# EasyEDA Pro project ProPrj_CWATCH_2025-07-30.epro, schematic Schematic2
Board Name: Board2; Create Date: 2025-07-18; Page Name: P1; Project Name: CWATCH; Schematic Name: Schematic2; Update Date: 2025-07-28; Company: EasyEDA.com; Page Size: A4; Version: V1.0
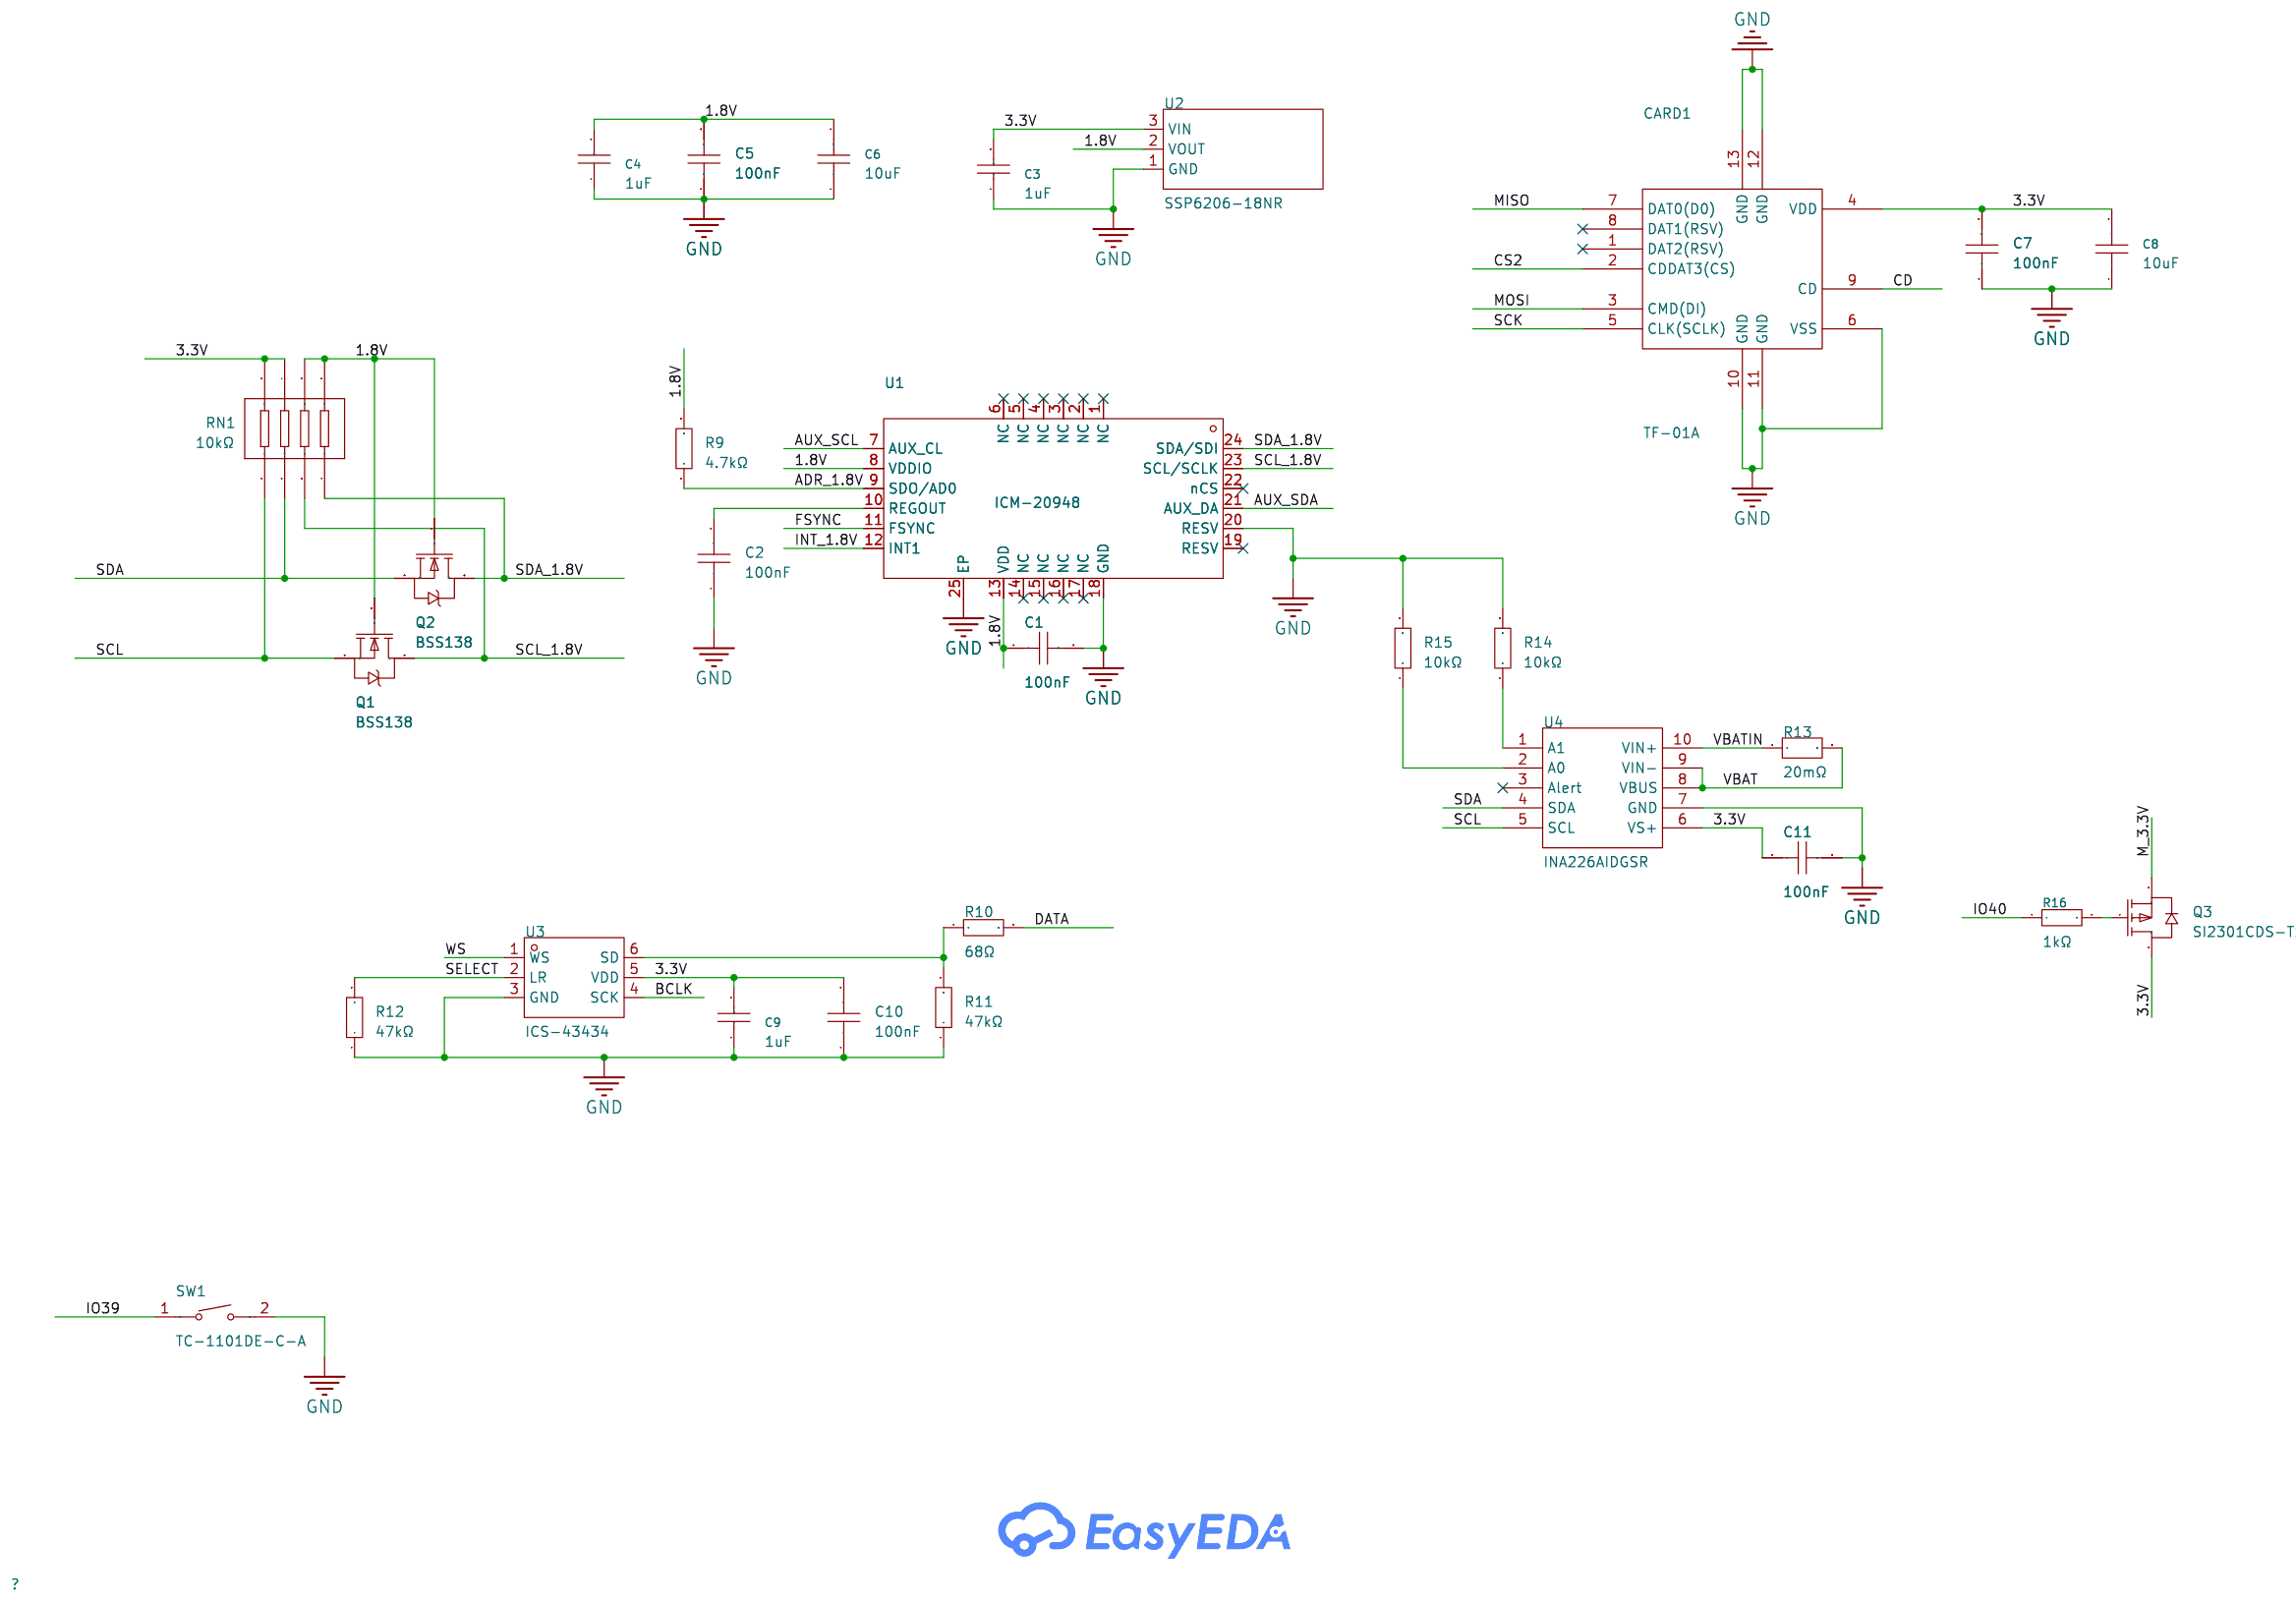
[diagram p2: schematic sheet]

## Parts
C1  100nF  [C0402]
C2  100nF  [C0402]
C3  1uF  [C0402]
C4  1uF  [C0402]
C5  100nF  [C0402]
C6  10uF  [C0603]
C7  100nF  [C0402]
C8  10uF  [C0603]
C9  1uF  [C0402]
C10  100nF  [C0402]
C11  100nF  [C0402]
CARD1  TF-01A  [TF-SMD_TF-01A]
Q1  BSS138  [SOT-23-3_L2.9-W1.6-P1.90-LS2.8-BR]
Q2  BSS138  [SOT-23-3_L2.9-W1.6-P1.90-LS2.8-BR]
Q3  SI2301CDS-T1-GE3  [SOT-23-3_L3.0-W1.7-P0.95-LS2.9-BR]
R9  4.7kΩ  [R0603]
R10  68Ω  [R0603]
R11  47kΩ  [R0402]
R12  47kΩ  [R0402]
R13  20mΩ  [RES-SMD_L6.4-W3.2-R2512]
R14  10kΩ  [R0402]
R15  10kΩ  [R0402]
R16  1kΩ  [R0402]
RN1  10kΩ  [RES-ARRAY-SMD_0402-8P-L2.0-W1.0-BL]
SW1  TC-1101DE-C-A  [KEY-TH_L6.1-W3.8-P5.08]
U1  ICM-20948  [QFN-24_L3.0-W3.0-P0.40-BL-EP]
U2  SSP6206-18NR  [SOT-23-3_L2.9-W1.3-P1.90-LS2.4-BR]
U3  ICS-43434  [MIC-SMD_6P-L3.5-W2.7-P0.90-BL]
U4  INA226AIDGSR  [MSOP-10_L3.0-W3.0-P0.50-LS5.0-BL]

## Library data of the parts
C1 C2 C5 C7 C10 C11 = CL05B104KB54PNC: Capacitance: Tolerance:±10% Tolerance:±10% Voltage Rated: Temperature Coefficient:; LCSC Part Name: 100nF ±10% 50V; Supplier Part: C307331; Manufacturer: SAMSUNG(三星); Supplier Footprint: 0402; JLCPCB Part Class: Basic Part; Datasheet: https://atta.szlcsc.com/upload/public/pdf/source/20160218/1457707763339.pdf; Supplier: LCSC; Tolerance: ±10%
C3 C4 C9 = CL05A105KA5NQNC: Capacitance: Tolerance:±10% Tolerance:±10% Voltage Rated: Temperature Coefficient:; LCSC Part Name: 1uF ±10% 25V; Supplier Part: C52923; Manufacturer: SAMSUNG(三星); Supplier Footprint: 0402; JLCPCB Part Class: Basic Part; Datasheet: https://atta.szlcsc.com/upload/public/pdf/source/20160218/1457707763339.pdf; Supplier: LCSC; Tolerance: ±10%
C6 C8 = CL10A106MA8NRNC: Capacitance: Tolerance:±20% Tolerance:±20% Voltage Rated: Temperature Coefficient:; LCSC Part Name: 10uF ±20% 25V; Supplier Part: C96446; Manufacturer: SAMSUNG(三星); Supplier Footprint: 0603; JLCPCB Part Class: Basic Part; Datasheet: https://atta.szlcsc.com/upload/public/pdf/source/20160218/1457707763339.pdf; Supplier: LCSC; Tolerance: ±20%
CARD1 = TF-01A_C91145: Card Connection Mode:Self-bouncing Card Type:MicroSD card (TF card) Connector Type:Card Slot Additional Card Detection Pins:- Supplementary Features:With Locating Pin Maximum Body Height:1.85mm Operating Temperature Range:- Operating Temperature Range:-; LCSC Part Name: 自弹式 MicroSD卡(TF卡) 卡座; Supplier Part: C91145; Manufacturer: 韩国韩荣; Supplier Footprint: SMD; JLCPCB Part Class: Extended Part; Datasheet: https://atta.szlcsc.com/upload/public/pdf/source/20190322/C91145_63CBD6FB4639A3A3EC6A9721F18AE0FB.pdf; Supplier: LCSC; Card Connection Mode: Self-bouncing; Card Type: MicroSD card (TF card); Connector Type: Card Slot; Supplementary Features: With Locating Pin; Maximum Body Height: 1.85mm
Q1 Q2 = BSS138_C52895: Type:1 N-Channel Drain Source Voltage (Vdss): Continuous Drain Current (Id):220mA Drain Source On Resistance (RDS(on)@Vgs,Id):3.5Ω@10V,0.22A Power Dissipation (Pd):360mW Gate Threshold Voltage (Vgs(th)@Id):1.5V@1mA Total Gate Charge (Qg@Vgs):2.4nC@25V Inp; LCSC Part Name: 1个N沟道 耐压:50V 电流:220mA; Supplier Part: C52895; Manufacturer: onsemi(安森美); Supplier Footprint: SOT-23; JLCPCB Part Class: Extended Part; Datasheet: https://atta.szlcsc.com/upload/public/pdf/source/20170412/1491969107299.pdf; Supplier: LCSC; Type: 1 N-Channel; Continuous Drain Current (Id): 220mA; Drain Source On Resistance (RDS(on)@Vgs,Id): 3.5Ω@10V,0.22A; Power Dissipation (Pd): 360mW; Gate Threshold Voltage (Vgs(th)@Id): 1.5V@1mA; Total Gate Charge (Qg@Vgs): 2.4nC@25V; Input Capacitance (Ciss@Vds): 27pF@25V; Reverse Transfer Capacitance (Crss@Vds): 6pF; Operating Temperature: -55℃~+150℃
Q3 = SI2301CDS-T1-GE3: Number:1 piece P-channel Drain to Source Voltage:20V Current - Continuous Drain(Id):2.3A RDS(on):112mΩ@4.5V,2.8A Pd - Power Dissipation:860mW Gate Threshold Voltage (Vgs(th)@Id):1V Gate Charge(Qg):3.3nC@10V Input Capacitance(Ciss@Vds):405pF@10V Reverse Tr; LCSC Part Name: 1个P沟道 耐压:20V 电流:2.3A; Supplier Part: C10487; Manufacturer: VISHAY(威世); Supplier Footprint: SOT-23; JLCPCB Part Class: Basic Part; Datasheet: https://atta.szlcsc.com/upload/public/pdf/source/20180621/C10487_757133A2CC00440C4C7DD3E7E73681E9.pdf; Supplier: LCSC; Number: 1 piece P-channel; Drain to Source Voltage: 20V; Current - Continuous Drain(Id): 2.3A; RDS(on): 112mΩ@4.5V,2.8A; Pd - Power Dissipation: 860mW; Gate Threshold Voltage (Vgs(th)@Id): 1V; Gate Charge(Qg): 3.3nC@10V; Input Capacitance(Ciss@Vds): 405pF@10V; Reverse Transfer Capacitance (Crss@Vds): 55pF@10V; Operating Temperature: -55℃~+150℃
R9 = 0603WAF4701T5E: Type:Thick Film Resistors Resistance:4.7kΩ Tolerance:±1% Tolerance:±1% Power(Watts): Overload Voltage (Max): Temperature Coefficient:±100ppm/℃ Temperature Coefficient:±100ppm/℃ Operating Temperature Range:-55℃~+155℃ Operating Temperature Range:-55℃~+155℃; LCSC Part Name: 4.7kΩ ±1% 100mW 厚膜电阻; Supplier Part: C23162; Manufacturer: UNI-ROYAL(厚声); Supplier Footprint: 0603; JLCPCB Part Class: Basic Part; Datasheet: https://atta.szlcsc.com/upload/public/pdf/source/20200306/C422600_1E6D84923E4A46A82E41ADD87F860B5C.pdf; Supplier: LCSC; Type: Thick Film Resistors; Tolerance: ±1%; Temperature Coefficient: ±100ppm/℃; Operating Temperature Range: -55℃~+155℃
R10 = 0603WAF680JT5E: Type:Thick Film Resistors Resistance:68Ω Tolerance:±1% Tolerance:±1% Power(Watts): Overload Voltage (Max): Temperature Coefficient:±100ppm/℃ Temperature Coefficient:±100ppm/℃ Operating Temperature Range:-55℃~+155℃ Operating Temperature Range:-55℃~+155℃; LCSC Part Name: 68Ω ±1% 100mW 厚膜电阻; Supplier Part: C27592; Manufacturer: UNI-ROYAL(厚声); Supplier Footprint: 0603; JLCPCB Part Class: Extended Part; Datasheet: https://atta.szlcsc.com/upload/public/pdf/source/20200306/C422600_1E6D84923E4A46A82E41ADD87F860B5C.pdf; Supplier: LCSC; Type: Thick Film Resistors; Tolerance: ±1%; Temperature Coefficient: ±100ppm/℃; Operating Temperature Range: -55℃~+155℃
R11 R12 = 0402WGF4702TCE: Type:Thick Film Resistors Resistance:47kΩ Tolerance:±1% Tolerance:±1% Power(Watts): Overload Voltage (Max): Temperature Coefficient:±100ppm/℃ Temperature Coefficient:±100ppm/℃ Operating Temperature Range:-55℃~+155℃ Operating Temperature Range:-55℃~+155℃; LCSC Part Name: 47kΩ ±1% 62.5mW 厚膜电阻; Supplier Part: C25792; Manufacturer: UNI-ROYAL(厚声); Supplier Footprint: 0402; JLCPCB Part Class: Basic Part; Datasheet: https://atta.szlcsc.com/upload/public/pdf/source/20200306/C422600_1E6D84923E4A46A82E41ADD87F860B5C.pdf; Supplier: LCSC; Type: Thick Film Resistors; Tolerance: ±1%; Temperature Coefficient: ±100ppm/℃; Operating Temperature Range: -55℃~+155℃
R13 = RLP25FEGR020: Type:- Resistance: Tolerance:±1% Tolerance:±1% Rated Output Voltage:- Power(Watts): Rated Current:- Temperature Coefficient:±50ppm/℃ Temperature Coefficient:±50ppm/℃ Mounting Sytle:; LCSC Part Name: 20mΩ ±1% 3W; Supplier Part: C393069; Manufacturer: 大毅科技; Supplier Footprint: 2512; JLCPCB Part Class: Extended Part; Datasheet: https://atta.szlcsc.com/upload/public/pdf/source/20191209/C467441_D59F70B0A5C6980F35DB1CB3CCA97CC4.pdf; Supplier: LCSC; Tolerance: ±1%; Temperature Coefficient: ±50ppm/℃
R14 R15 = 0402WGF1002TCE: Type:Thick Film Resistors Resistance:10kΩ Tolerance:±1% Tolerance:±1% Power(Watts): Overload Voltage (Max): Temperature Coefficient:±100ppm/℃ Temperature Coefficient:±100ppm/℃ Operating Temperature Range:-55℃~+155℃ Operating Temperature Range:-55℃~+155℃; LCSC Part Name: 10kΩ ±1% 62.5mW 厚膜电阻; Supplier Part: C25744; Manufacturer: UNI-ROYAL(厚声); Supplier Footprint: 0402; JLCPCB Part Class: Basic Part; Datasheet: https://atta.szlcsc.com/upload/public/pdf/source/20200306/C422600_1E6D84923E4A46A82E41ADD87F860B5C.pdf; Supplier: LCSC; Type: Thick Film Resistors; Tolerance: ±1%; Temperature Coefficient: ±100ppm/℃; Operating Temperature Range: -55℃~+155℃
R16 = 0402WGF1001TCE: Type:Thick Film Resistors Resistance:1kΩ Tolerance:±1% Tolerance:±1% Power(Watts): Overload Voltage (Max): Temperature Coefficient:±100ppm/℃ Temperature Coefficient:±100ppm/℃ Operating Temperature Range:-55℃~+155℃ Operating Temperature Range:-55℃~+155℃; LCSC Part Name: 1kΩ ±1% 62.5mW 厚膜电阻; Supplier Part: C11702; Manufacturer: UNI-ROYAL(厚声); Supplier Footprint: 0402; JLCPCB Part Class: Basic Part; Datasheet: https://atta.szlcsc.com/upload/public/pdf/source/20200306/C422600_1E6D84923E4A46A82E41ADD87F860B5C.pdf; Supplier: LCSC; Type: Thick Film Resistors; Tolerance: ±1%; Temperature Coefficient: ±100ppm/℃; Operating Temperature Range: -55℃~+155℃
RN1 = 4D02WGJ0103TCE: Number of Resistors: Resistance:10kΩ Tolerance:±5% Tolerance:±5% Power(Watts): Temperature Coefficient:±200ppm/℃ Temperature Coefficient:±200ppm/℃ Number of Pins:; LCSC Part Name: 10kΩ ±5%; Supplier Part: C25725; Manufacturer: UNI-ROYAL(厚声); Supplier Footprint: 0402x4; JLCPCB Part Class: Extended Part; Datasheet: https://atta.szlcsc.com/upload/public/pdf/source/20191224/C474318_2527498AE30E813171187CCD28401A71.pdf; Supplier: LCSC; Tolerance: ±5%; Temperature Coefficient: ±200ppm/℃
SW1 = TC-1101DE-C-A: Circuit:SPST Actuator Style:Rectangle button Operating Force:260gf Mounting Style:Lying Switch Length:6.1mm Switch Width:3.55mm Switch Height:1.1mm Strike Gundam:不带 Contact Current:50mA Voltage Rating (DC):12V Insulation Resistance:- Actuator/Cap Color:Wh; LCSC Part Name: 6.1*3.55*1.1mm 卧插 轻触开关; Supplier Part: C318995; Manufacturer: XKB Connectivity(中国星坤); Supplier Footprint: 插件; JLCPCB Part Class: Extended Part; Datasheet: https://atta.szlcsc.com/upload/public/pdf/source/20211011/ED36BF06846E3E8410FF4E7398452331.pdf; Supplier: LCSC; Circuit: SPST; Actuator Style: Rectangle button; Operating Force: 260gf; Mounting Style: Lying; Switch Length: 6.1mm; Switch Width: 3.55mm; Switch Height: 1.1mm; Strike Gundam: 不带; Contact Current: 50mA; Voltage Rating (DC): 12V; Actuator/Cap Color: White; With Lamp: No; Pin Style: PCPin; Mechanical Life: 50000次; Operating Temperature: -20℃~+70℃
U1 = ICM-20948: Sensor Type:Accelerometer gyroscope Operating Temperature:-40℃~+85℃ Operating Temperature:-40℃~+85℃; Supplier Part: C726001; Manufacturer: TDK InvenSense(应美盛); Supplier Footprint: QFN-24(3x3); JLCPCB Part Class: Extended Part; Datasheet: https://atta.szlcsc.com/upload/public/pdf/source/20210715/C726001_EFE09342631EBC06FA98BEAE6CEEEE9D.pdf; Supplier: LCSC; Sensor Type: Accelerometer gyroscope; Operating Temperature: -40℃~+85℃
U2 = SSP6206-18NR: Output Type:Fixed Voltage - Supply:8V Output Voltage:1.8V Output Voltage:1.8V Output Current:300mA Power Supply Rejection Ratio (PSRR):50dB@(1kHz) Voltage Dropout:420mV@(100mA) Output Configuration:Positive electrode Number of Outputs:1; LCSC Part Name: 输入8V 输出1.8V 300mA; Supplier Part: C277878; Manufacturer: Siproin(上海矽朋); Supplier Footprint: SOT-23; JLCPCB Part Class: Extended Part; Datasheet: https://atta.szlcsc.com/upload/public/pdf/source/20240407/6D2F72AFACB8BAEC20CCC024846FBA04.pdf; Supplier: LCSC; Output Type: Fixed; Voltage - Supply: 8V; Output Voltage: 1.8V; Output Current: 300mA; Power Supply Rejection Ratio (PSRR): 50dB@(1kHz); Voltage Dropout: 420mV@(100mA); Output Configuration: Positive electrode; Number of Outputs: 1
U3 = ICS-43434_C5656610: Direction:Omni-directional Voltage - Supply:1.65V~3.63V Voltage - Supply:1.65V~3.63V Current Consumption:550uA Current Consumption:550uA S/N Ratio:64dB Sensitivity:- Sensitivity:-; Supplier Part: C5656610; Manufacturer: TDK InvenSense(应美盛); JLCPCB Part Class: Extended Part; Datasheet: https://atta.szlcsc.com/upload/public/pdf/source/231023/DS-000069-ICS-43434-v1.2-8194c7772d771e21a553109502704f97.pdf; Supplier: LCSC; Direction: Omni-directional; Voltage - Supply: 1.65V~3.63V; Current Consumption: 550uA; S/N Ratio: 64dB
U4 = INA226AIDGSR: Number of Channels:- Vcm - Common Mode Voltage:300mV~40V Vcm - Common Mode Voltage:300mV~40V Gain:- Bandwidth:- Ib - Input Bias Current:- Vos - Input Offset Voltage:- Voltage - Supply:2.7V~5.5V Voltage - Supply:2.7V~5.5V Current - Supply:- Operating Tempe; Supplier Part: C49851; Manufacturer: TI(德州仪器); Supplier Footprint: MSOP-10; JLCPCB Part Class: Extended Part; Datasheet: https://atta.szlcsc.com/upload/public/pdf/source/20231204/F50A9EB86BE78FEA83E070C913617774.pdf; Supplier: LCSC; Vcm - Common Mode Voltage: 300mV~40V; Voltage - Supply: 2.7V~5.5V; Operating Temperature: -40℃~+125℃

## Nets
1.8V: C1.1 C4.2 C5.2 C6.2 Q1.1(G) Q2.1(G) R9.2 RN1.5 RN1.6 U1.8(VDDIO) U1.13(VDD) U2.2(VOUT)
3.3V: C3.2 C7.2 C8.2 C9.2 C10.2 C11.1 CARD1.4(VDD) Q3.3(D) RN1.7 RN1.8 U2.3(VIN) U3.5(VDD) U4.6(VS+)
GND: C1.2 C2.1 C3.1 C4.1 C5.1 C6.1 C7.1 C8.1 C9.1 C10.1 C11.2 CARD1.6(VSS) CARD1.10(GND) CARD1.11(GND) CARD1.12(GND) CARD1.13(GND) R11.1 R12.1 R14.2 R15.2 SW1.2 U1.18(GND) U1.20(RESV) U1.25(EP) U2.1(GND) U3.3(GND) U4.7(GND)
VBAT: R13.2 U4.8(VBUS) U4.9(VIN-)
VBATIN: R13.1 U4.10(VIN+)
ADR_1.8V: R9.1 U1.9(SDO/AD0)
AUX_SCL: U1.7(AUX_CL)
AUX_SDA: U1.21(AUX_DA)
BCLK: U3.4(SCK)
CD: CARD1.9(CD)
CS2: CARD1.2(CDDAT3(CS))
DATA: R10.2
FSYNC: U1.11(FSYNC)
INT_1.8V: U1.12(INT1)
IO39: SW1.1
IO40: R16.1
M_3.3V: Q3.2(S)
MISO: CARD1.7(DAT0(D0))
MOSI: CARD1.3(CMD(DI))
SCK: CARD1.5(CLK(SCLK))
SCL: Q1.2(S) RN1.1 U4.5(SCL)
SCL_1.8V: Q1.3(D) RN1.3 U1.23(SCL/SCLK)
SDA: Q2.2(S) RN1.2 U4.4(SDA)
SDA_1.8V: Q2.3(D) RN1.4 U1.24(SDA/SDI)
SELECT: R12.2 U3.2(LR)
WS: U3.1(WS)
$1N443: C2.2 U1.10(REGOUT)
$1N2802: R10.1 R11.2 U3.6(SD)
$1N4154: R14.1 U4.1(A1)
$1N4205: R15.1 U4.2(A0)
$1N6080: Q3.1(G) R16.2

Not connected (* = marked no-connect by the designer): CARD1 1(DAT2(RSV))* 8(DAT1(RSV))*; U1 1(NC)* 2(NC)* 3(NC)* 4(NC)* 5(NC)* 6(NC)* 14(NC)* 15(NC)* 16(NC)* 17(NC)* 19(RESV)* 22(nCS)*; U4 3(Alert)*
